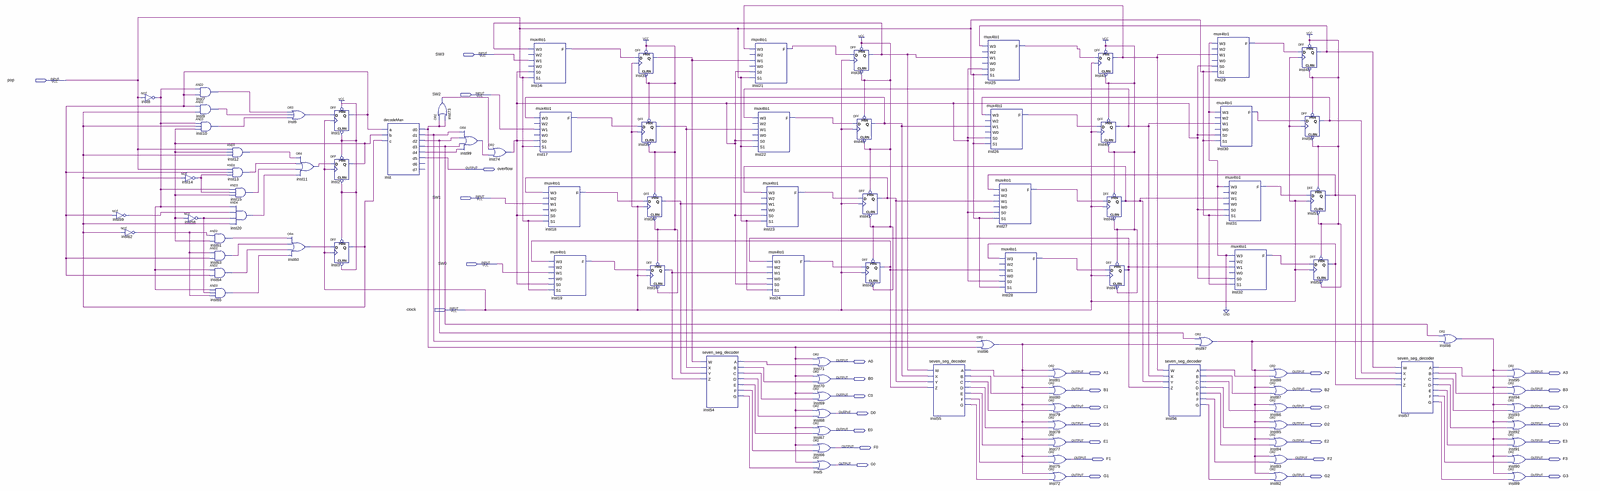
[diagram p0: schematic sheet, whole]
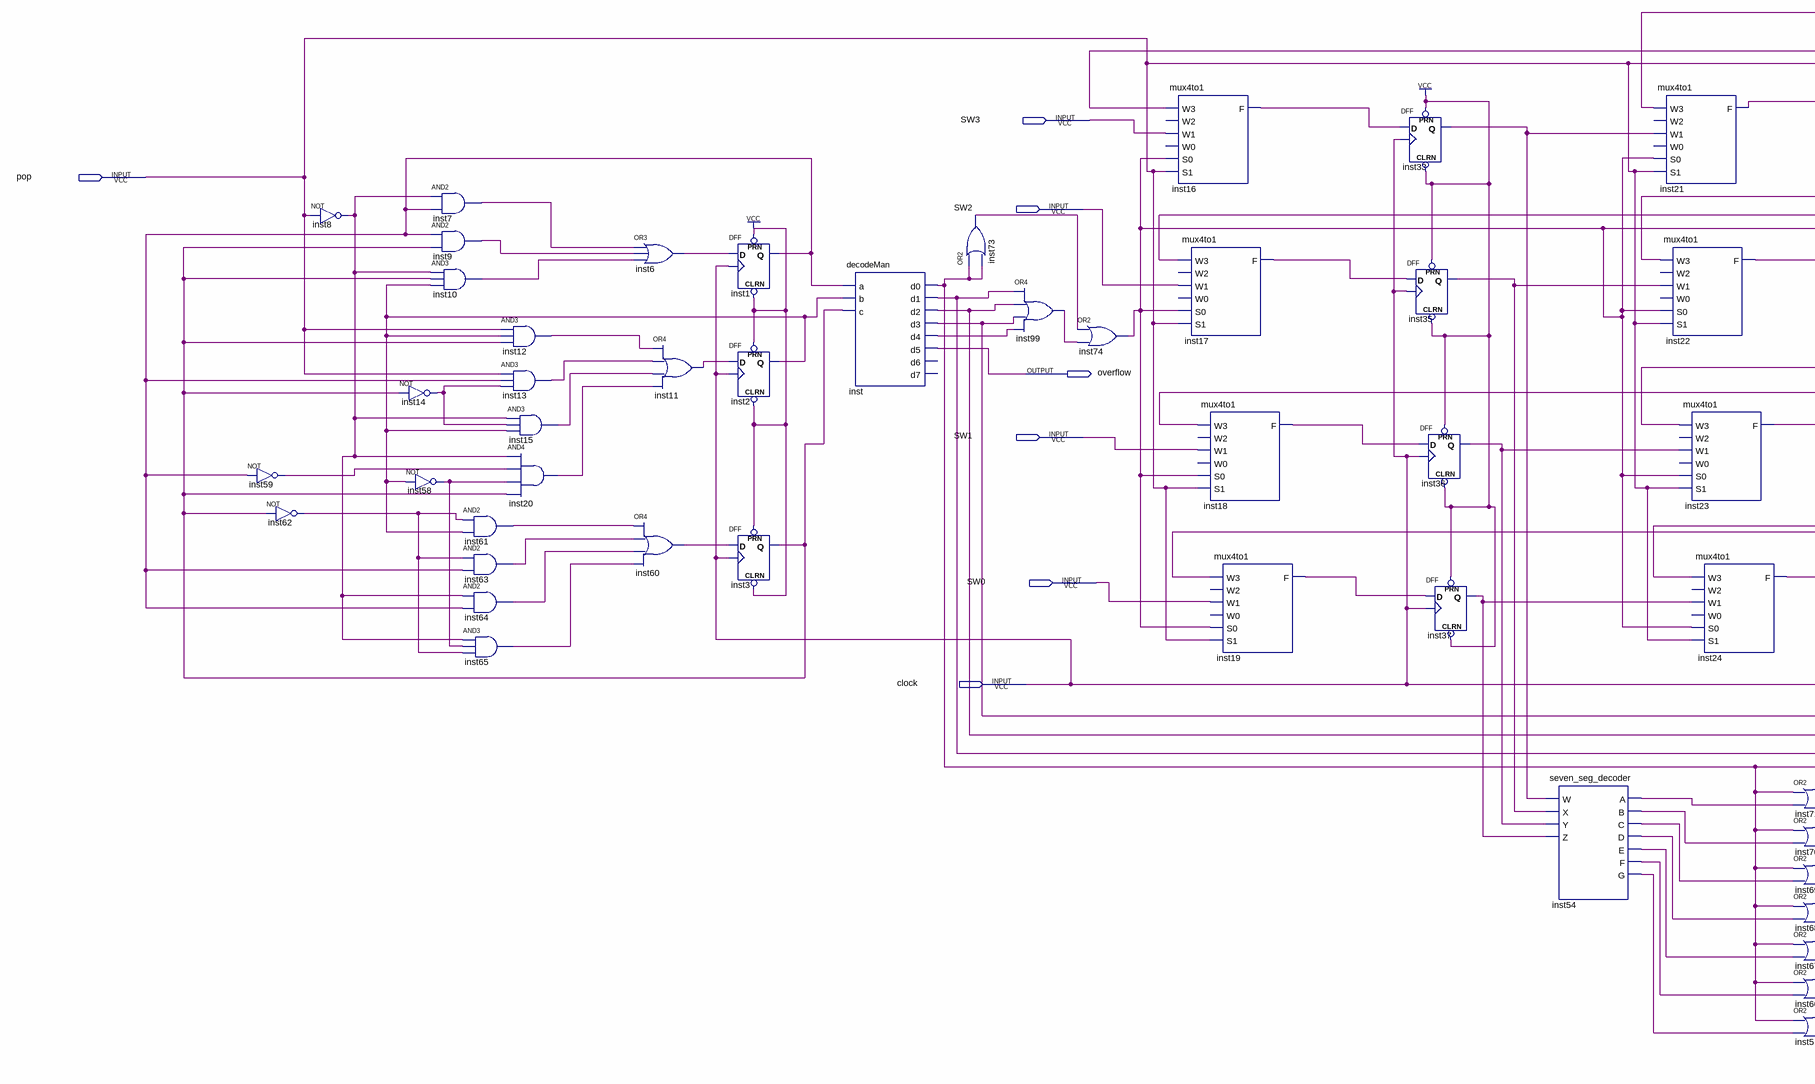
[diagram p1: schematic sheet, left part]
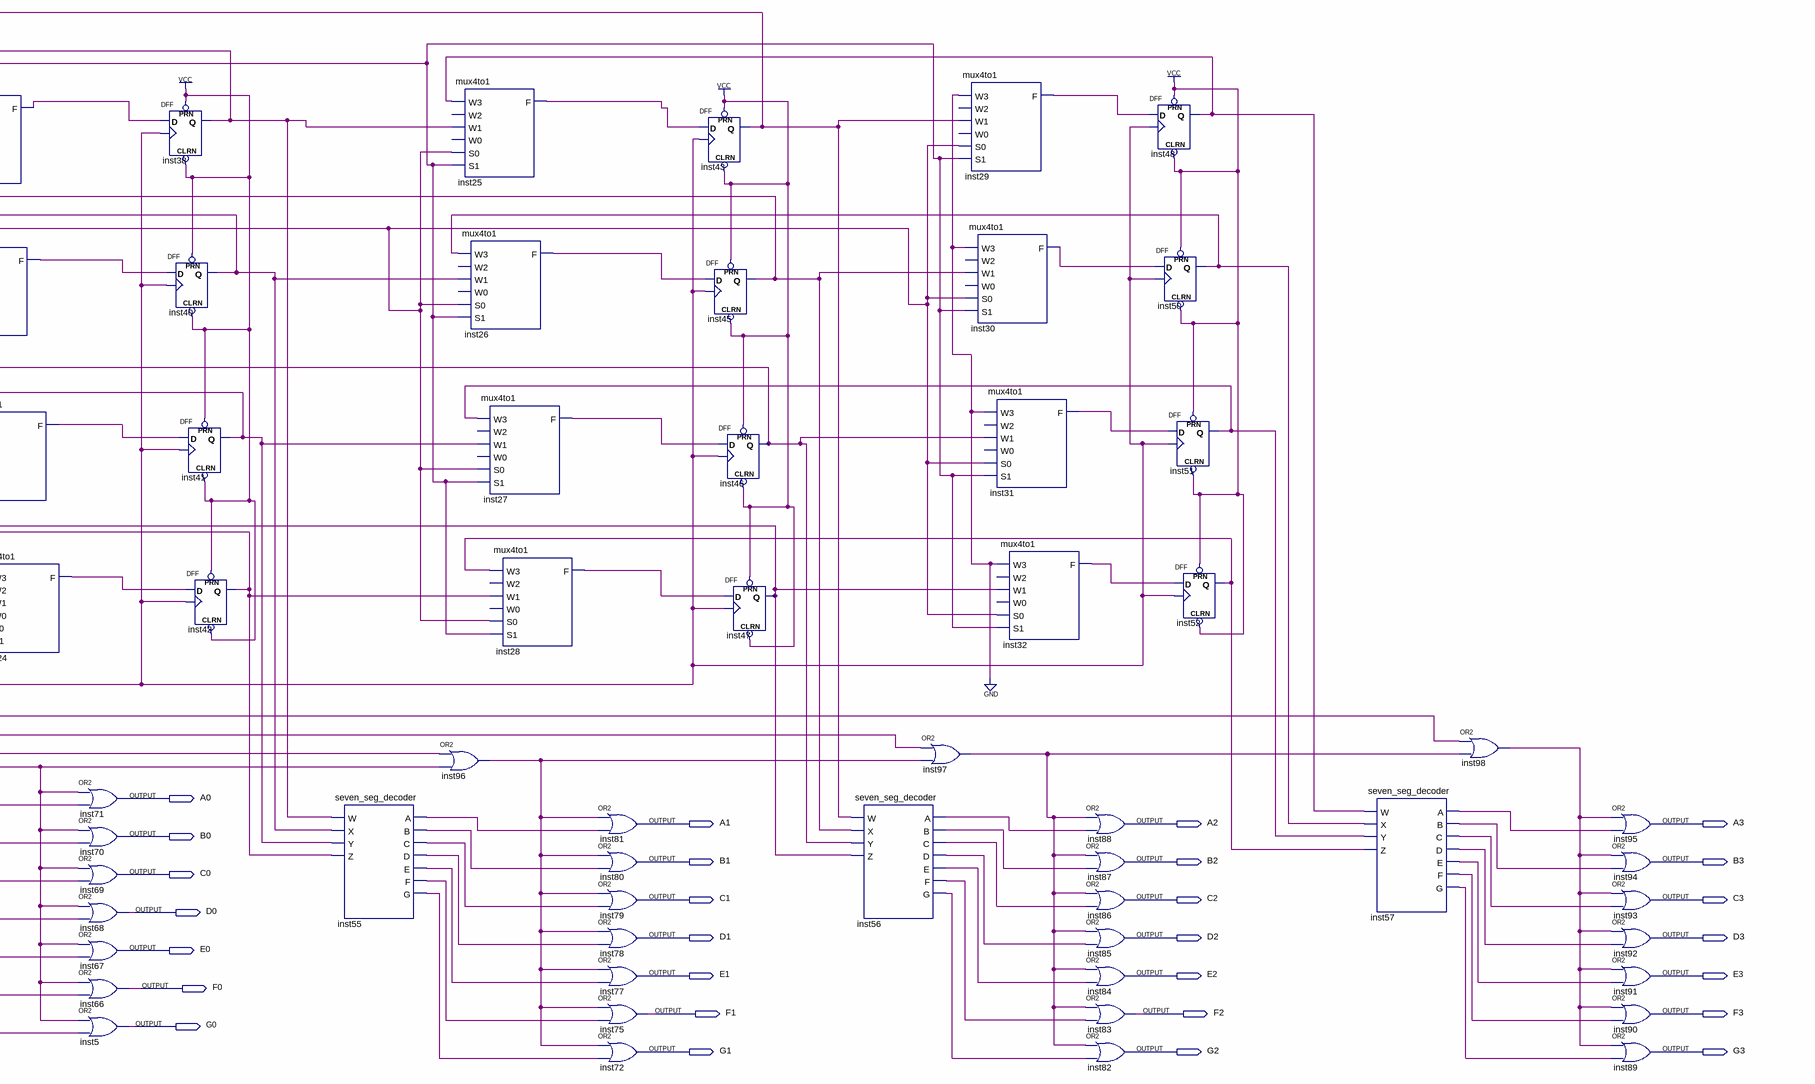
[diagram p2: schematic sheet, right part]
// Quartus schematic Pop.bdf as structural Verilog: 93 symbols, 35 pins
module Pop (
  input  SW3,
  input  pop,
  input  SW2,
  input  SW1,
  input  SW0,
  input  clock,
  output overflow,
  output A0,
  output A1,
  output A2,
  output A3,
  output B0,
  output B1,
  output B2,
  output B3,
  output C0,
  output C1,
  output C2,
  output C3,
  output D0,
  output D1,
  output D2,
  output D3,
  output E0,
  output E1,
  output E2,
  output E3,
  output F0,
  output F1,
  output F2,
  output F3,
  output G0,
  output G1,
  output G2,
  output G3
);

  wire inst1_q, inst2_q, inst3_q, inst6_out, inst7_out, inst8_out, inst9_out, inst10_out, inst11_out,
       inst12_out, inst13_out, inst14_out, inst15_out, inst16_f, inst17_f, inst18_f, inst19_f, inst20_out,
       inst21_f, inst22_f, inst23_f, inst24_f, inst25_f, inst26_f, inst27_f, inst28_f, inst29_f, inst30_f,
       inst31_f, inst32_f, inst33_q, inst35_q, inst36_q, inst37_q, inst38_q, inst40_q, inst41_q, inst42_q,
       inst43_q, inst45_q, inst46_q, inst47_q, inst48_q, inst50_q, inst51_q, inst52_q, inst54_a, inst54_b,
       inst54_c, inst54_d, inst54_e, inst54_f, inst54_g, inst55_a, inst55_b, inst55_c, inst55_d, inst55_e,
       inst55_f, inst55_g, inst56_a, inst56_b, inst56_c, inst56_d, inst56_e, inst56_f, inst56_g, inst57_a,
       inst57_b, inst57_c, inst57_d, inst57_e, inst57_f, inst57_g, inst58_out, inst59_out, inst60_out,
       inst61_out, inst62_out, inst63_out, inst64_out, inst65_out, inst73_out, inst74_out, inst96_out,
       inst97_out, inst98_out, inst99_out, inst_d0, inst_d1, inst_d2, inst_d3, inst_d4;

  not inst59 (inst59_out, inst1_q);
  not inst62 (inst62_out, inst3_q);
  not inst8 (inst8_out, pop);
  not inst14 (inst14_out, inst3_q);
  and inst7 (inst7_out, inst8_out, inst1_q);
  and inst9 (inst9_out, inst1_q, inst3_q);
  and inst10 (inst10_out, inst8_out, inst3_q, inst2_q);
  not inst58 (inst58_out, inst2_q);
  and inst12 (inst12_out, pop, inst2_q, inst3_q);
  and inst13 (inst13_out, pop, inst1_q, inst14_out);
  and inst61 (inst61_out, inst62_out, inst2_q);
  and inst63 (inst63_out, inst62_out, inst1_q);
  and inst64 (inst64_out, inst8_out, inst1_q);
  and inst65 (inst65_out, inst8_out, inst58_out, inst62_out);
  and inst15 (inst15_out, inst8_out, inst14_out, inst2_q);
  and inst20 (inst20_out, inst8_out, inst59_out, inst58_out, inst3_q);
  or inst6 (inst6_out, inst7_out, inst9_out, inst10_out);
  or inst11 (inst11_out, inst12_out, inst13_out, inst15_out, inst20_out);
  or inst60 (inst60_out, inst61_out, inst63_out, inst64_out, inst65_out);
  DFF inst1 (.CLRN(1'b1), .CLK(clock), .D(inst6_out), .PRN(1'b1), .Q(inst1_q));
  DFF inst2 (.CLRN(1'b1), .CLK(clock), .D(inst11_out), .PRN(1'b1), .Q(inst2_q));
  DFF inst3 (.CLRN(1'b1), .CLK(clock), .D(inst60_out), .PRN(1'b1), .Q(inst3_q));
  decodeMan inst (
    .a(inst1_q), .b(inst2_q), .c(inst3_q), .d0(inst_d0), .d1(inst_d1), .d2(inst_d2), .d3(inst_d3),
    .d4(inst_d4), .d5(overflow));  // open: d6, d7
  or inst73 (inst73_out, inst_d0, inst_d0);
  or inst99 (inst99_out, inst_d1, inst_d2, inst_d3, inst_d4);
  or inst74 (inst74_out, inst73_out, inst99_out);
  mux4to1 inst16 (.W3(inst38_q), .W1(SW3), .S0(inst74_out), .S1(pop), .F(inst16_f));  // open: W2, W0
  mux4to1 inst17 (.W3(inst40_q), .W1(SW2), .S0(inst74_out), .S1(pop), .F(inst17_f));  // open: W2, W0
  mux4to1 inst18 (.W3(inst41_q), .W1(SW1), .S0(inst74_out), .S1(pop), .F(inst18_f));  // open: W2, W0
  mux4to1 inst19 (.W3(inst42_q), .W1(SW0), .S0(inst74_out), .S1(pop), .F(inst19_f));  // open: W2, W0
  DFF inst33 (.CLRN(1'b1), .CLK(clock), .D(inst16_f), .PRN(1'b1), .Q(inst33_q));
  DFF inst35 (.CLRN(1'b1), .CLK(clock), .D(inst17_f), .PRN(1'b1), .Q(inst35_q));
  DFF inst36 (.CLRN(1'b1), .CLK(clock), .D(inst18_f), .PRN(1'b1), .Q(inst36_q));
  DFF inst37 (.CLRN(1'b1), .CLK(clock), .D(inst19_f), .PRN(1'b1), .Q(inst37_q));
  seven_seg_decoder inst54 (
    .W(inst33_q), .X(inst35_q), .Y(inst36_q), .Z(inst37_q), .A(inst54_a), .B(inst54_b), .C(inst54_c),
    .D(inst54_d), .E(inst54_e), .F(inst54_f), .G(inst54_g));
  mux4to1 inst21 (.W3(inst43_q), .W1(inst33_q), .S0(inst74_out), .S1(pop), .F(inst21_f));  // open: W2, W0
  mux4to1 inst22 (.W3(inst45_q), .W1(inst35_q), .S0(inst74_out), .S1(pop), .F(inst22_f));  // open: W2, W0
  mux4to1 inst23 (.W3(inst46_q), .W1(inst36_q), .S0(inst74_out), .S1(pop), .F(inst23_f));  // open: W2, W0
  mux4to1 inst24 (.W3(inst47_q), .W1(inst37_q), .S0(inst74_out), .S1(pop), .F(inst24_f));  // open: W2, W0
  or inst71 (A0, inst_d0, inst54_a);
  or inst70 (B0, inst_d0, inst54_b);
  or inst69 (C0, inst_d0, inst54_c);
  or inst68 (D0, inst_d0, inst54_d);
  or inst67 (E0, inst_d0, inst54_e);
  or inst66 (F0, inst_d0, inst54_f);
  or inst5 (G0, inst_d0, inst54_g);
  DFF inst38 (.CLRN(1'b1), .CLK(clock), .D(inst21_f), .PRN(1'b1), .Q(inst38_q));
  DFF inst40 (.CLRN(1'b1), .CLK(clock), .D(inst22_f), .PRN(1'b1), .Q(inst40_q));
  DFF inst41 (.CLRN(1'b1), .CLK(clock), .D(inst23_f), .PRN(1'b1), .Q(inst41_q));
  DFF inst42 (.CLRN(1'b1), .CLK(clock), .D(inst24_f), .PRN(1'b1), .Q(inst42_q));
  seven_seg_decoder inst55 (
    .W(inst38_q), .X(inst40_q), .Y(inst41_q), .Z(inst42_q), .A(inst55_a), .B(inst55_b), .C(inst55_c),
    .D(inst55_d), .E(inst55_e), .F(inst55_f), .G(inst55_g));
  mux4to1 inst25 (.W3(inst48_q), .W1(inst38_q), .S0(inst74_out), .S1(pop), .F(inst25_f));  // open: W2, W0
  mux4to1 inst26 (.W3(inst50_q), .W1(inst40_q), .S0(inst74_out), .S1(pop), .F(inst26_f));  // open: W2, W0
  or inst96 (inst96_out, inst_d1, inst_d0);
  mux4to1 inst27 (.W3(inst51_q), .W1(inst41_q), .S0(inst74_out), .S1(pop), .F(inst27_f));  // open: W2, W0
  mux4to1 inst28 (.W3(inst52_q), .W1(inst42_q), .S0(inst74_out), .S1(pop), .F(inst28_f));  // open: W2, W0
  or inst81 (A1, inst96_out, inst55_a);
  or inst80 (B1, inst96_out, inst55_b);
  or inst79 (C1, inst96_out, inst55_c);
  or inst78 (D1, inst96_out, inst55_d);
  or inst77 (E1, inst96_out, inst55_e);
  or inst75 (F1, inst96_out, inst55_f);
  or inst72 (G1, inst96_out, inst55_g);
  DFF inst43 (.CLRN(1'b1), .CLK(clock), .D(inst25_f), .PRN(1'b1), .Q(inst43_q));
  DFF inst45 (.CLRN(1'b1), .CLK(clock), .D(inst26_f), .PRN(1'b1), .Q(inst45_q));
  DFF inst46 (.CLRN(1'b1), .CLK(clock), .D(inst27_f), .PRN(1'b1), .Q(inst46_q));
  DFF inst47 (.CLRN(1'b1), .CLK(clock), .D(inst28_f), .PRN(1'b1), .Q(inst47_q));
  seven_seg_decoder inst56 (
    .W(inst43_q), .X(inst45_q), .Y(inst46_q), .Z(inst47_q), .A(inst56_a), .B(inst56_b), .C(inst56_c),
    .D(inst56_d), .E(inst56_e), .F(inst56_f), .G(inst56_g));
  mux4to1 inst29 (.W3(1'b0), .W1(inst43_q), .S0(inst74_out), .S1(pop), .F(inst29_f));  // open: W2, W0
  mux4to1 inst30 (.W3(1'b0), .W1(inst45_q), .S0(inst74_out), .S1(pop), .F(inst30_f));  // open: W2, W0
  or inst97 (inst97_out, inst_d2, inst96_out);
  mux4to1 inst31 (.W3(1'b0), .W1(inst46_q), .S0(inst74_out), .S1(pop), .F(inst31_f));  // open: W2, W0
  mux4to1 inst32 (.W3(1'b0), .W1(inst47_q), .S0(inst74_out), .S1(pop), .F(inst32_f));  // open: W2, W0
  or inst88 (A2, inst97_out, inst56_a);
  or inst87 (B2, inst97_out, inst56_b);
  or inst86 (C2, inst97_out, inst56_c);
  or inst85 (D2, inst97_out, inst56_d);
  or inst84 (E2, inst97_out, inst56_e);
  or inst83 (F2, inst97_out, inst56_f);
  or inst82 (G2, inst97_out, inst56_g);
  DFF inst48 (.CLRN(1'b1), .CLK(clock), .D(inst29_f), .PRN(1'b1), .Q(inst48_q));
  DFF inst50 (.CLRN(1'b1), .CLK(clock), .D(inst30_f), .PRN(1'b1), .Q(inst50_q));
  DFF inst51 (.CLRN(1'b1), .CLK(clock), .D(inst31_f), .PRN(1'b1), .Q(inst51_q));
  DFF inst52 (.CLRN(1'b1), .CLK(clock), .D(inst32_f), .PRN(1'b1), .Q(inst52_q));
  seven_seg_decoder inst57 (
    .W(inst48_q), .X(inst50_q), .Y(inst51_q), .Z(inst52_q), .A(inst57_a), .B(inst57_b), .C(inst57_c),
    .D(inst57_d), .E(inst57_e), .F(inst57_f), .G(inst57_g));
  or inst98 (inst98_out, inst_d3, inst97_out);
  or inst95 (A3, inst98_out, inst57_a);
  or inst94 (B3, inst98_out, inst57_b);
  or inst93 (C3, inst98_out, inst57_c);
  or inst92 (D3, inst98_out, inst57_d);
  or inst91 (E3, inst98_out, inst57_e);
  or inst90 (F3, inst98_out, inst57_f);
  or inst89 (G3, inst98_out, inst57_g);
endmodule
